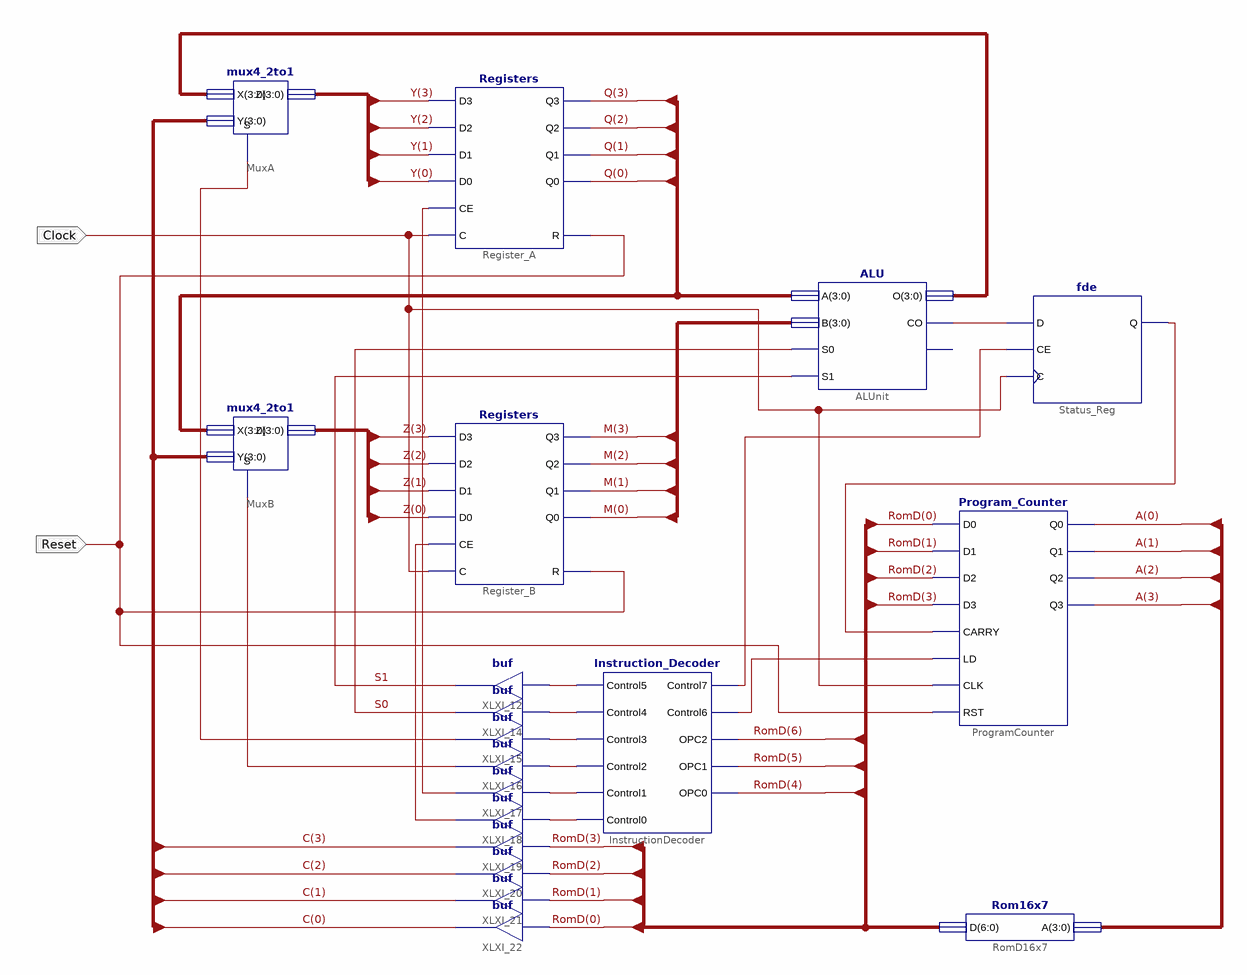
[diagram p0: schematic sheet 1]
// Xilinx ISE schematic Final_Project.sch (virtex6) as structural Verilog: 19 symbols, 2 ports
module Final_Project (
  input  Clock,
  input  Reset
);

  wire S0, S1, XLXN_32, XLXN_33, XLXN_49, XLXN_63, XLXN_64, XLXN_67, XLXN_77, XLXN_78, XLXN_79, XLXN_80,
       XLXN_81, XLXN_82, XLXN_83, XLXN_84;
  wire [3:0] A, C, M, Q, XLXN_34, Y, Z;
  wire [6:0] RomD;

  mux4_2to1 MuxA (.S(XLXN_33), .X(XLXN_34), .Y(C), .Z(Y));
  mux4_2to1 MuxB (.S(XLXN_32), .X(Q), .Y(C), .Z(Z));
  buf XLXI_12 (S1, XLXN_79);
  buf XLXI_14 (S0, XLXN_80);
  buf XLXI_15 (XLXN_33, XLXN_81);
  buf XLXI_16 (XLXN_32, XLXN_82);
  buf XLXI_17 (XLXN_77, XLXN_83);
  buf XLXI_18 (XLXN_78, XLXN_84);
  buf XLXI_19 (C[3], RomD[3]);
  buf XLXI_20 (C[2], RomD[2]);
  buf XLXI_21 (C[1], RomD[1]);
  buf XLXI_22 (C[0], RomD[0]);
  ALU ALUnit (.A(Q), .B(M), .CO(XLXN_49), .O(XLXN_34), .S0(S0), .S1(S1));  // open: OFL
  fde Status_Reg (.C(Clock), .CE(XLXN_64), .D(XLXN_49), .Q(XLXN_63));
  Program_Counter ProgramCounter (
    .CARRY(XLXN_63), .CLK(Clock), .D0(RomD[0]), .D1(RomD[1]), .D2(RomD[2]), .D3(RomD[3]), .LD(XLXN_67),
    .Q0(A[0]), .Q1(A[1]), .Q2(A[2]), .Q3(A[3]), .RST(Reset));
  Instruction_Decoder InstructionDecoder (
    .Control0(XLXN_84), .Control1(XLXN_83), .Control2(XLXN_82), .Control3(XLXN_81), .Control4(XLXN_80),
    .Control5(XLXN_79), .Control6(XLXN_67), .Control7(XLXN_64), .OPC0(RomD[4]), .OPC1(RomD[5]), .OPC2(RomD[6]));
  Registers Register_A (
    .C(Clock), .CE(XLXN_77), .D0(Y[0]), .D1(Y[1]), .D2(Y[2]), .D3(Y[3]), .Q0(Q[0]), .Q1(Q[1]), .Q2(Q[2]),
    .Q3(Q[3]), .R(Reset));
  Registers Register_B (
    .C(Clock), .CE(XLXN_78), .D0(Z[0]), .D1(Z[1]), .D2(Z[2]), .D3(Z[3]), .Q0(M[0]), .Q1(M[1]), .Q2(M[2]),
    .Q3(M[3]), .R(Reset));
  Rom16x7 RomD16x7 (.A(A), .D(RomD));
endmodule
